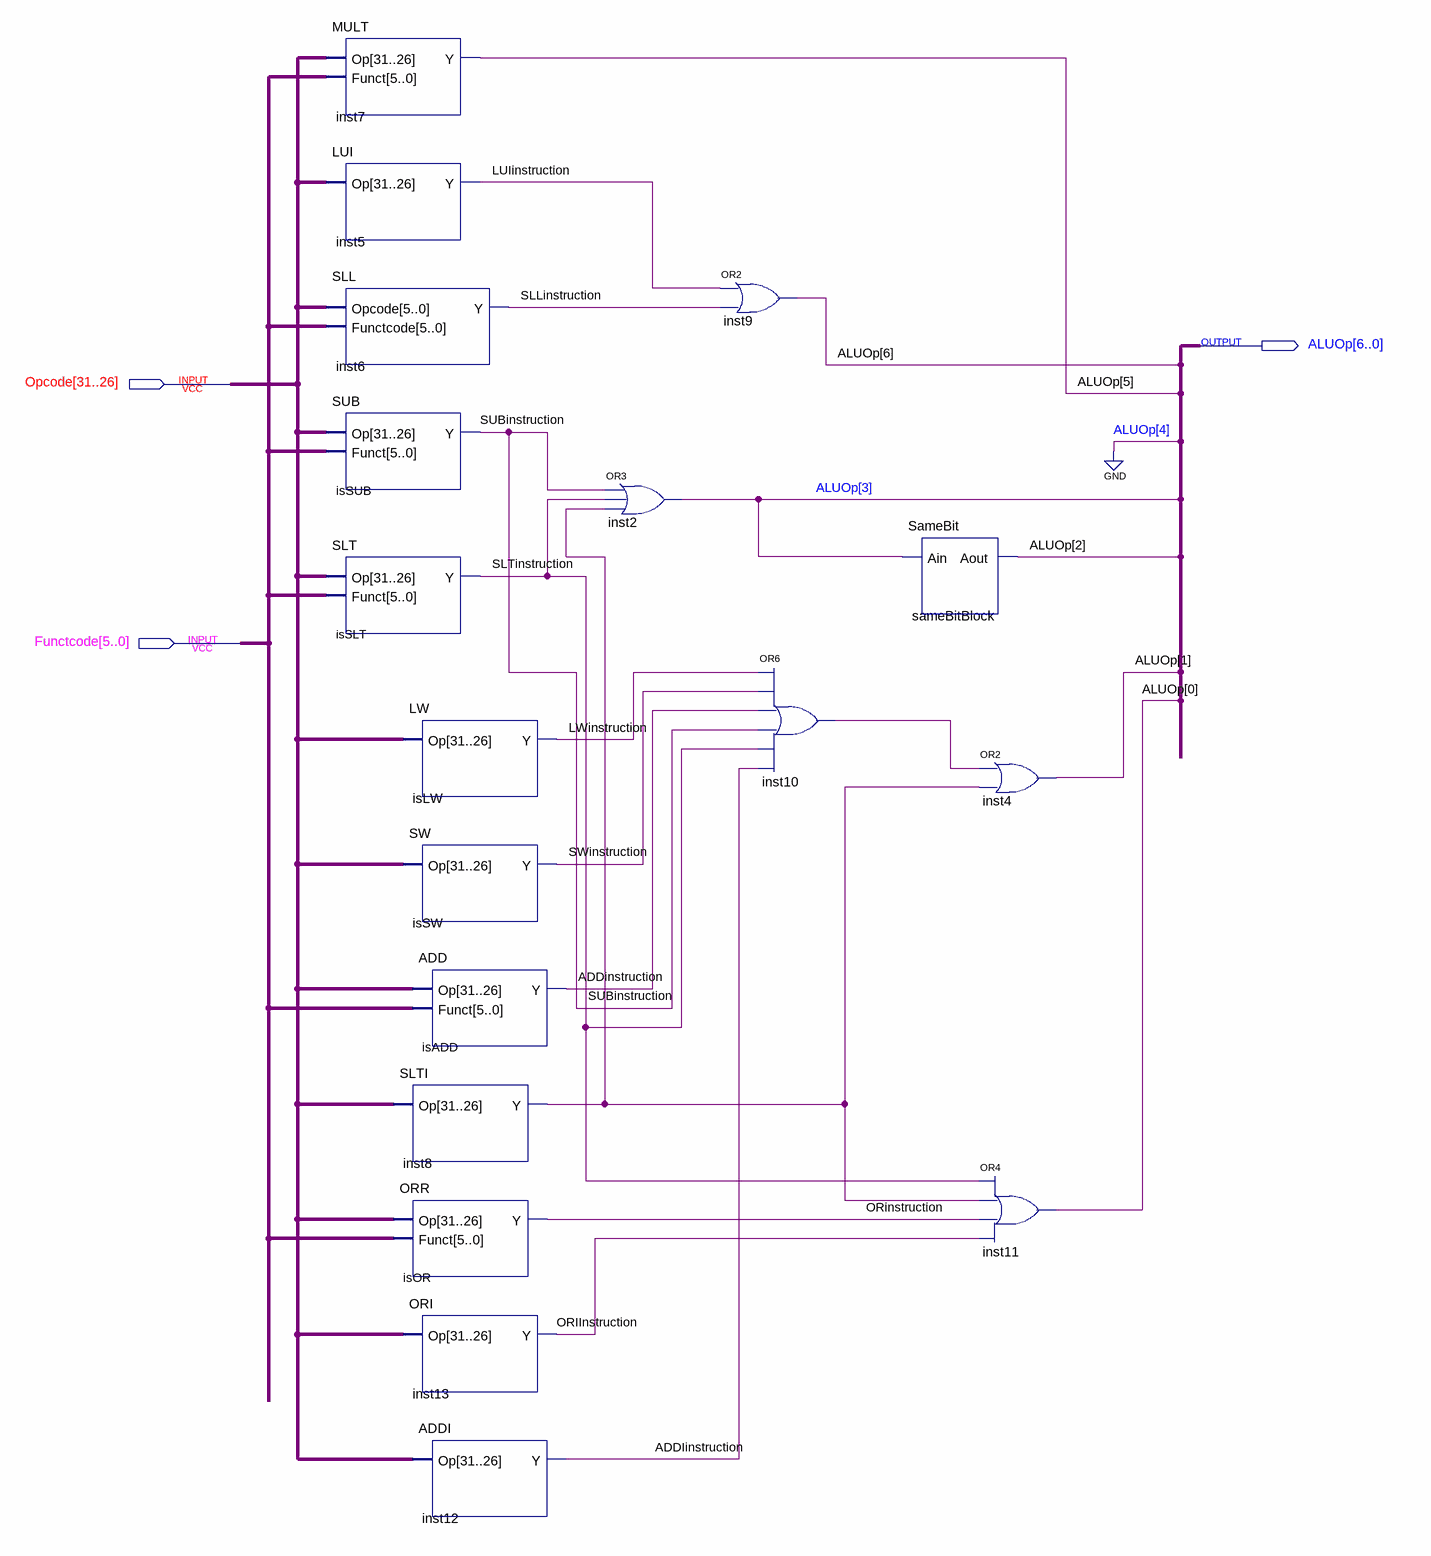
[diagram p0: schematic sheet]
// Quartus schematic ALUCtl.bdf as structural Verilog: 18 symbols, 3 pins
module ALUCtl (
  input  [31:26] Opcode,
  input  [5:0] Functcode,
  output [6:0] ALUOp
);

  wire ADDIinstruction, ADDinstruction, inst8_y, inst10_out, LUIinstruction, LWinstruction, ORIInstruction,
       ORinstruction, SLLinstruction, SLTinstruction, SUBinstruction, SWinstruction;

  MULT inst7 (.Op(Opcode), .Funct(Functcode), .Y(ALUOp[5]));
  LUI inst5 (.Op(Opcode), .Y(LUIinstruction));
  SLL inst6 (.Opcode(Opcode), .Functcode(Functcode), .Y(SLLinstruction));
  SUB isSUB (.Op(Opcode), .Funct(Functcode), .Y(SUBinstruction));
  SLT isSLT (.Op(Opcode), .Funct(Functcode), .Y(SLTinstruction));
  LW isLW (.Op(Opcode), .Y(LWinstruction));
  SW isSW (.Op(Opcode), .Y(SWinstruction));
  ADD isADD (.Op(Opcode), .Funct(Functcode), .Y(ADDinstruction));
  SLTI inst8 (.Op(Opcode), .Y(inst8_y));
  ORR isOR (.Op(Opcode), .Funct(Functcode), .Y(ORinstruction));
  ORI inst13 (.Op(Opcode), .Y(ORIInstruction));
  ADDI inst12 (.Op(Opcode), .Y(ADDIinstruction));
  or inst2 (ALUOp[3], SUBinstruction, SLTinstruction, inst8_y);
  or inst9 (ALUOp[6], LUIinstruction, SLLinstruction);
  or inst10 (inst10_out, LWinstruction, SWinstruction, ADDinstruction, SUBinstruction, SLTinstruction, ADDIinstruction);
  SameBit sameBitBlock (.Ain(ALUOp[3]), .Aout(ALUOp[2]));
  or inst4 (ALUOp[1], inst10_out, inst8_y);
  or inst11 (ALUOp[0], SLTinstruction, inst8_y, ORinstruction, ORIInstruction);

  assign ALUOp[4] = 1'b0;
endmodule
